# EAGLE design logic_alpha0001 (EAGLE 6.4)
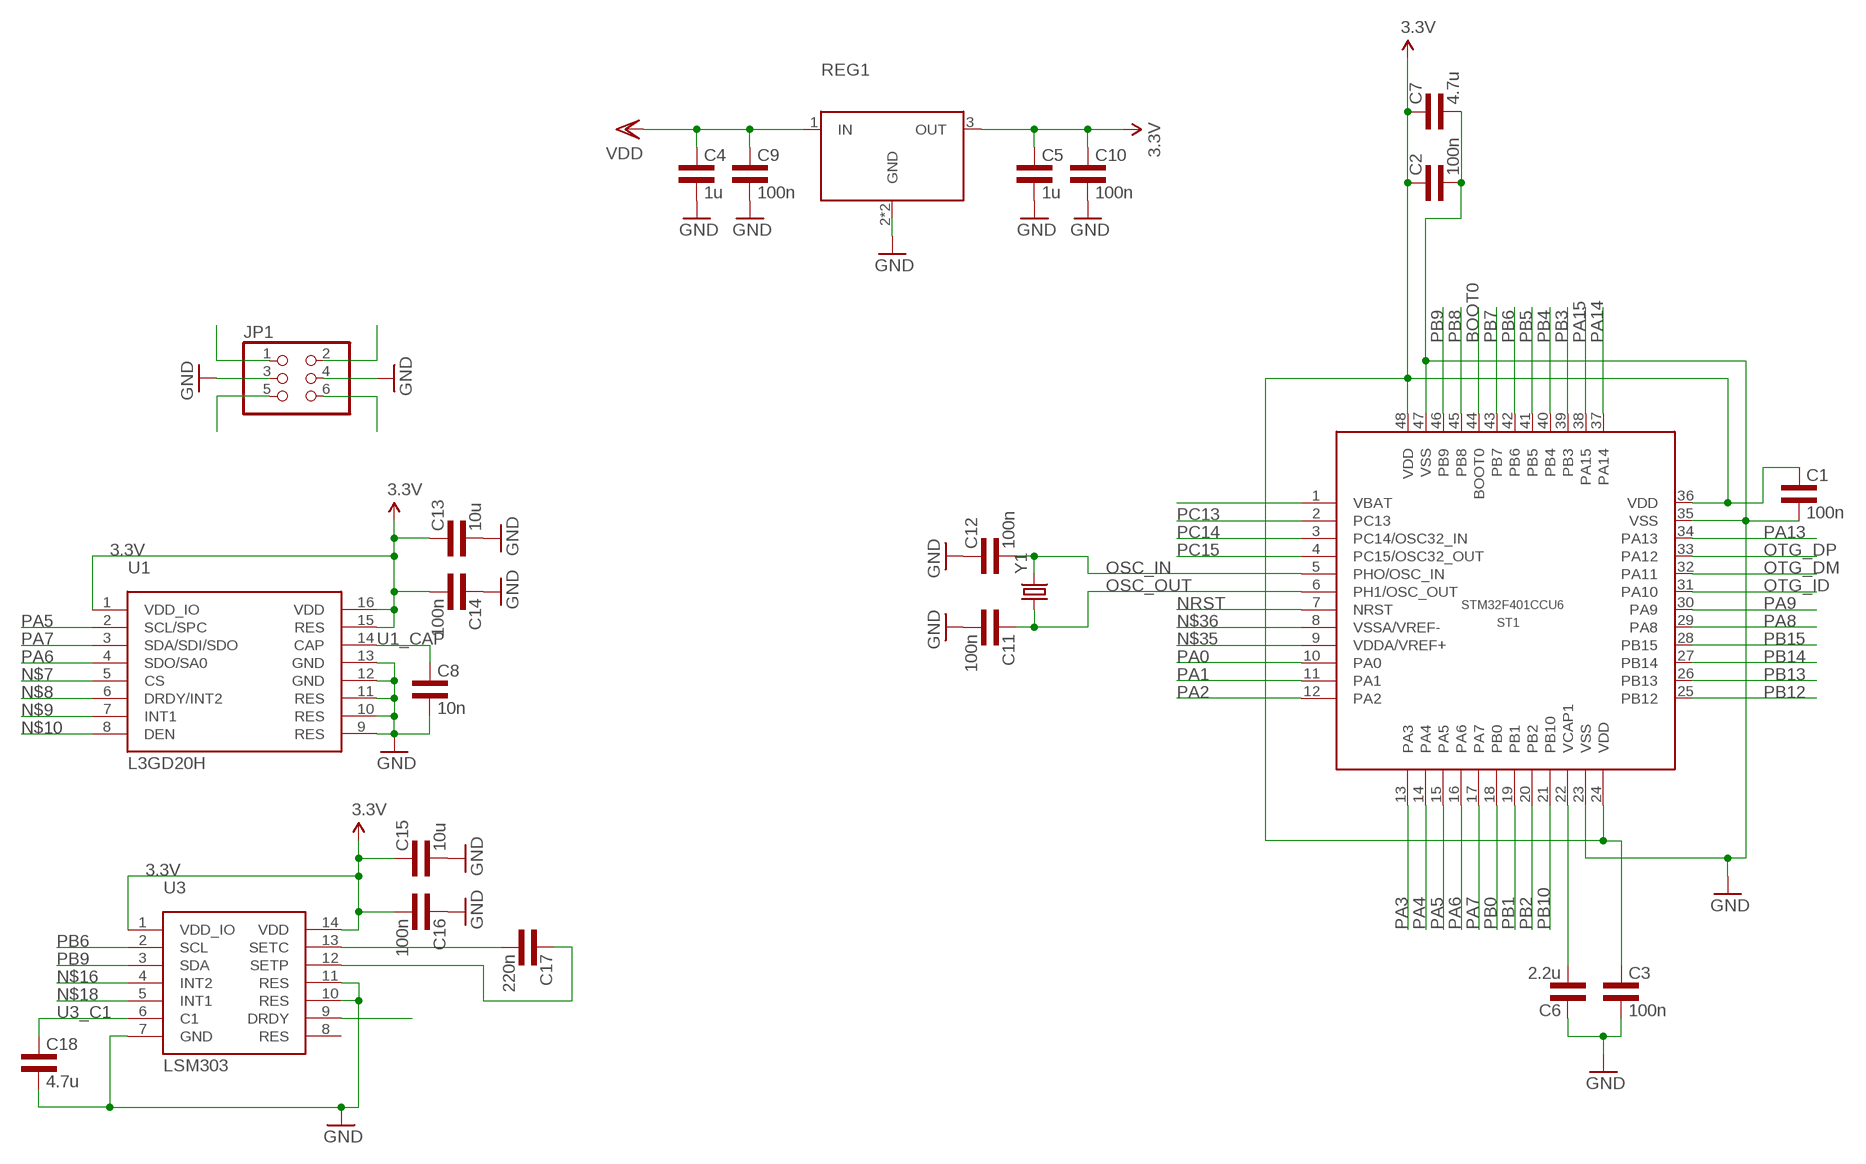
[diagram p0: schematic, sheet 1]

## Parts
C1  100n  CAP0402L3  [0402L3]
C2  100n  CAP0402L3  [0402L3]
C3  100n  CAP0402L3  [0402L3]
C4  1u  CAP0805L3  [0805L3]
C5  1u  CAP0805L3  [0805L3]
C6  2.2u  CAP0402L3  [0402L3]
C7  4.7u  CAP0805L3  [0805L3]
C8  10n  CAP0603L3  [0603L3]
C9  100n  CAP0603L3  [0603L3]
C10  100n  CAP0603L3  [0603L3]
C11  100n  CAP0402L3  [0402L3]
C12  100n  CAP0402L3  [0402L3]
C13  10u  CAP0805L3  [0805L3]
C14  100n  CAP0603L3  [0603L3]
C15  10u  CAP0805L3  [0805L3]
C16  100n  CAP0603L3  [0603L3]
C17  220n  CAP0603L3  [0603L3]
C18  4.7u  CAP0603L3  [0603L3]
JP1  PINHD-2X3  [2X03]
REG1  LDO_REG_4PIN  [SOT-223-3]
ST1  STM32F401CCU6  [UFQFPN48]
U1  L3GD20H  [LGA16R50P3X5_300X300X100]
U3  LSM303  [LGA14]
Y1  CRYSTALHC49US  [HC49US]

## Nets
3.3V: C1.P$1 C2.P$1 C3.P$1 C5.1 C7.1 C10.P$1 C13.1 C14.P$2 C15.1 C16.P$2 REG1.3(OUT) ST1.24(VDD) ST1.36(VDD) ST1.48(VDD) U1.1(VDD_IO) U1.15(RES) U1.16(VDD) U3.1(VDD_IO) U3.14(VDD)
BOOT0: ST1.44(BOOT0)
GND: C1.P$2 C2.P$2 C3.P$2 C4.2 C5.2 C6.P$1 C7.2 C8.P$2 C9.P$2 C10.P$2 C11.P$2 C12.P$1 C13.2 C14.P$1 C15.2 C16.P$1 C18.P$2 JP1.3 JP1.4 REG1.2(GND) REG1.4(GND) ST1.23(VSS) ST1.35(VSS) ST1.47(VSS) U1.9(RES) U1.10(RES) U1.11(RES) U1.12(GND) U1.13(GND) U3.7(GND) U3.10(RES) U3.11(RES)
HIN1_IN: JP1.1
HIN2_IN: JP1.5
LIN1_IN: JP1.2
LIN2_IN: JP1.6
N$6: ST1.1(VBAT)
N$7: U1.5(CS)
N$8: U1.6(DRDY/INT2)
N$9: U1.7(INT1)
N$10: U1.8(DEN)
N$16: U3.4(INT2)
N$17: C6.P$2 ST1.22(VCAP1)
N$18: U3.5(INT1)
N$20: C17.P$2 U3.13(SETC)
N$21: C17.P$1 U3.12(SETP)
N$22: U3.9(DRDY)
N$35: ST1.9(VDDA/VREF+)
N$36: ST1.8(VSSA/VREF-)
NRST: ST1.7(NRST)
OSC_IN: C12.P$2 ST1.5(PHO/OSC_IN) Y1.2
OSC_OUT: C11.P$1 ST1.6(PH1/OSC_OUT) Y1.1
OTG_DM: ST1.32(PA11)
OTG_DP: ST1.33(PA12)
OTG_ID: ST1.31(PA10)
PA0: ST1.10(PA0)
PA1: ST1.11(PA1)
PA2: ST1.12(PA2)
PA3: ST1.13(PA3)
PA4: ST1.14(PA4)
PA5: ST1.15(PA5) U1.2(SCL/SPC)
PA6: ST1.16(PA6) U1.4(SDO/SA0)
PA7: ST1.17(PA7) U1.3(SDA/SDI/SDO)
PA8: ST1.29(PA8)
PA9: ST1.30(PA9)
PA13: ST1.34(PA13)
PA14: ST1.37(PA14)
PA15: ST1.38(PA15)
PB0: ST1.18(PB0)
PB1: ST1.19(PB1)
PB2: ST1.20(PB2)
PB3: ST1.39(PB3)
PB4: ST1.40(PB4)
PB5: ST1.41(PB5)
PB6: ST1.42(PB6) U3.2(SCL)
PB7: ST1.43(PB7)
PB8: ST1.45(PB8)
PB9: ST1.46(PB9) U3.3(SDA)
PB10: ST1.21(PB10)
PB12: ST1.25(PB12)
PB13: ST1.26(PB13)
PB14: ST1.27(PB14)
PB15: ST1.28(PB15)
PC13: ST1.2(PC13)
PC14: ST1.3(PC14/OSC32_IN)
PC15: ST1.4(PC15/OSC32_OUT)
U1_CAP: C8.P$1 U1.14(CAP)
U3_C1: C18.P$1 U3.6(C1)
VDD: C4.1 C9.P$1 REG1.1(IN)
Unconnected: U3.8(RES)

## Library data of the parts
C1-C18 = common:CAP
JP1 = pinhead:PINHD-2X3: PIN HEADER
REG1 = common:LDO_REG_4PIN
ST1 = common:STM32F401CCU6
U1 = ST Microelctronics_By_element14_Batch_1:L3GD20H
U3 = SparkFun-Sensors:LSM303
Y1 = SparkFun-FreqCtrl:CRYSTAL: Various standard crystals. Proven footprints. Spark Fun Electronics SKU : COM-00534

## Board
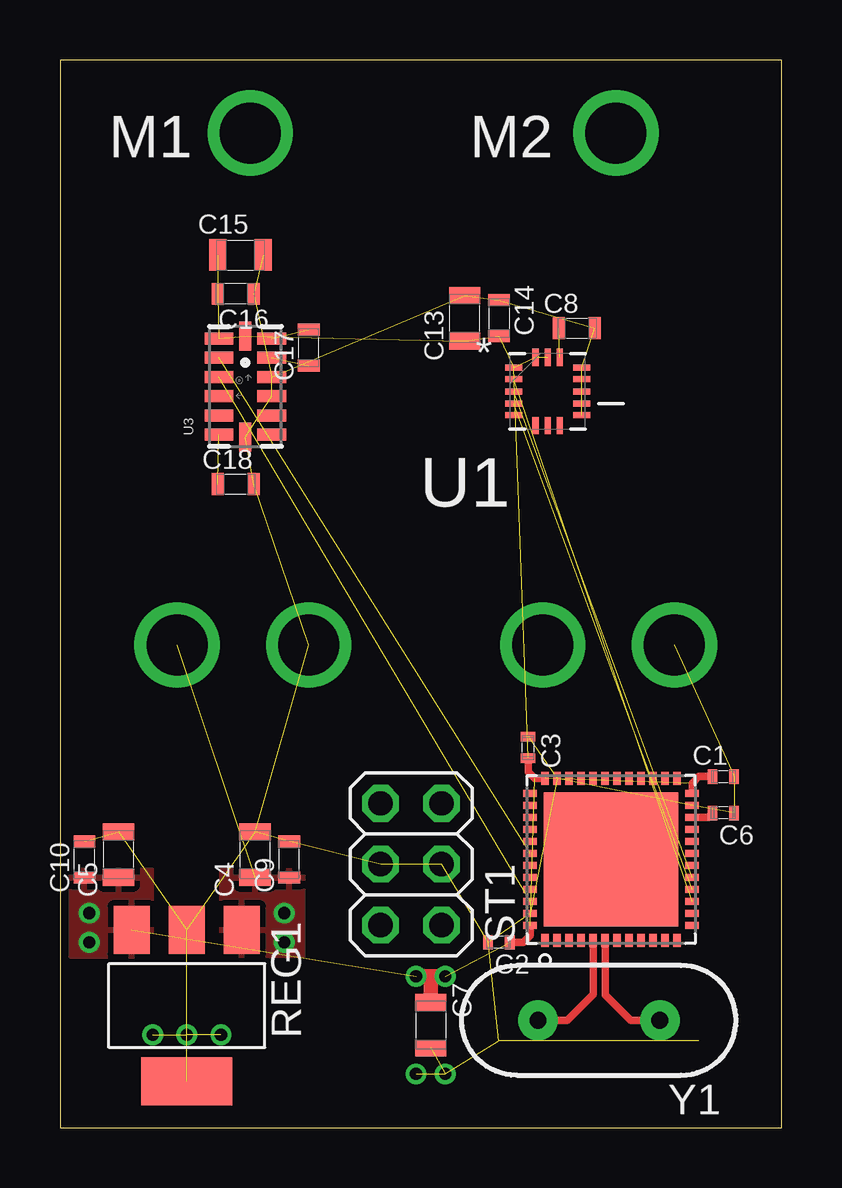
[diagram p1: board, top side]
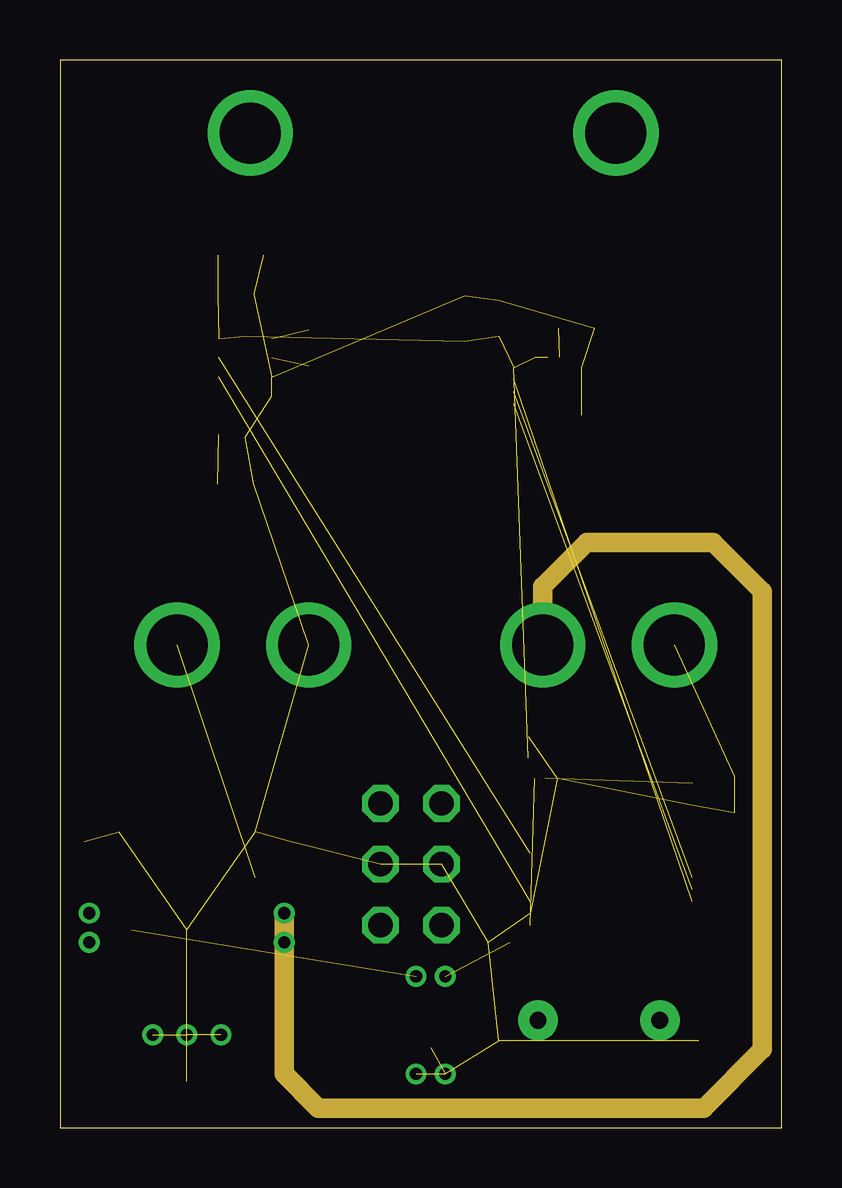
[diagram p2: board, inner layer Route3]
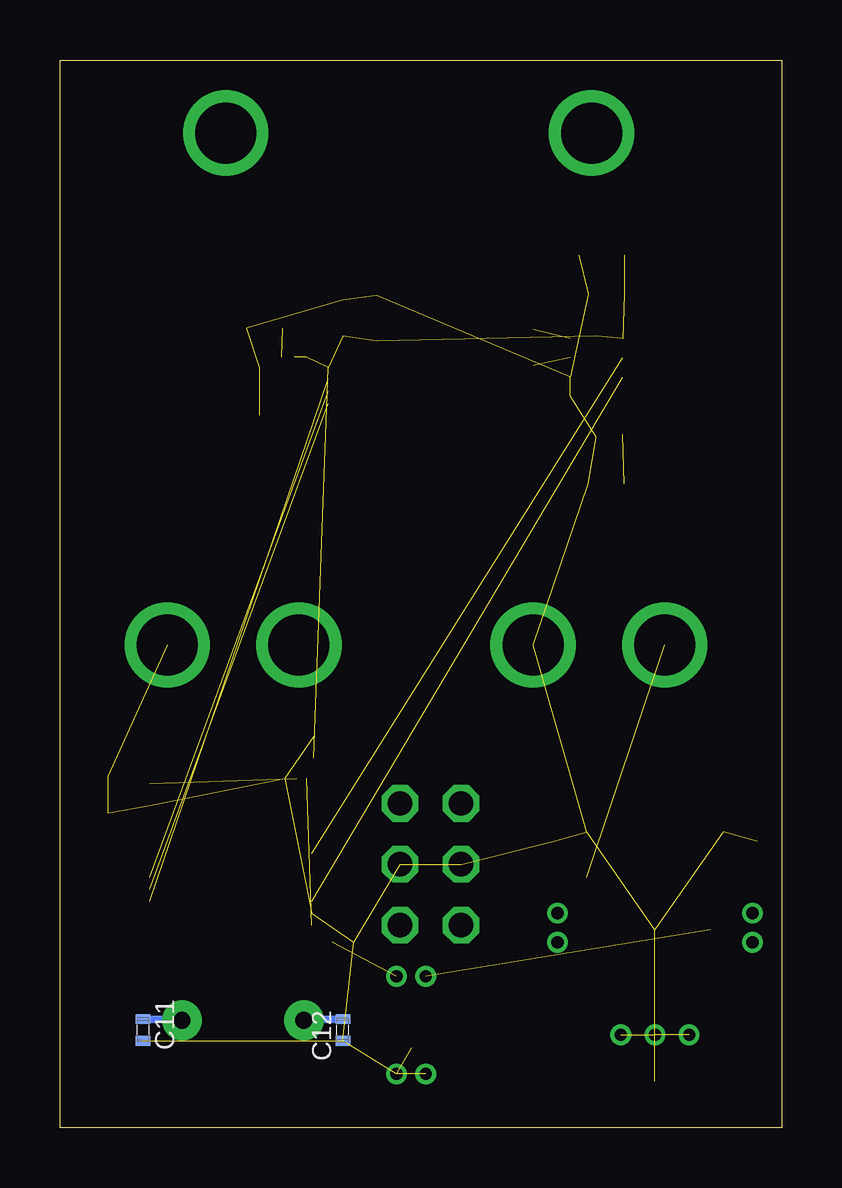
[diagram p3: board, bottom side, seen from below]

Size 30.07 x 44.5 mm. Coordinates in mm from the lower left corner, seen from the top.
Outline: 0,0 30.07,0 30.07,44.5 0,44.5 0,0
Copper layers (1*16): Top 0.035mm / dielectric 1.5mm / Bottom 0.035mm
Design rules "default *": minimum track width 8mil, minimum drill 13mil, track to track 8mil, track to pad 8mil, pad to pad 8mil, via to via 8mil, smd to smd 8mil, copper to edge 13mil, drill to drill 8mil, minimum pad ring 7mil, minimum via ring 7mil, stop-mask expansion 4mil, vias tented up to drill 0mil, thermal gap 10mil

### Footprints (pad centres in the part's own frame; a part is rotated, then mirrored left to right if it is on the bottom)
0402L3 = smd 0.4 x 0.6: P$1 -0.45,0; P$2 0.45,0
0805L3 = smd 0.7 x 1.3: 1 -0.95,0; 2 0.95,0
0603L3 = smd 0.5 x 0.9: P$1 -0.75,0; P$2 0.75,0
2X03 = drill 1.016 octagon: 1 -2.54,-1.27; 2 -2.54,1.27; 3 0,-1.27; 4 0,1.27; 5 2.54,-1.27; 6 2.54,1.27
SOT-223-3 = smd 1.5 x 2: 1 -2.3,-3.15; 2 0,-3.15; 3 2.3,-3.15 | smd 3.8 x 2: 4 0,3.15
UFQFPN48 = smd 0.55 x 0.3: 1 -3.375,2.75; 2 -3.375,2.25; 3 -3.375,1.75; 4 -3.375,1.25; 5 -3.375,0.75; 6 -3.375,0.25; 7 -3.375,-0.25; 8 -3.375,-0.75; 9 -3.375,-1.25; 10 -3.375,-1.75; 11 -3.375,-2.25; 12 -3.375,-2.75; 25 3.375,-2.75; 26 3.375,-2.25; 27 3.375,-1.75; 28 3.375,-1.25; 29 3.375,-0.75; 30 3.375,-0.25; 31 3.375,0.25; 32 3.375,0.75; 33 3.375,1.25; 34 3.375,1.75; 35 3.375,2.25; 36 3.375,2.75 | smd 0.3 x 0.55: 13 -2.75,-3.375; 14 -2.25,-3.375; 15 -1.75,-3.375; 16 -1.25,-3.375; 17 -0.75,-3.375; 18 -0.25,-3.375; 19 0.25,-3.375; 20 0.75,-3.375; 21 1.25,-3.375; 22 1.75,-3.375; 23 2.25,-3.375; 24 2.75,-3.375; 37 2.75,3.375; 38 2.25,3.375; 39 1.75,3.375; 40 1.25,3.375; 41 0.75,3.375; 42 0.25,3.375; 43 -0.25,3.375; 44 -0.75,3.375; 45 -1.25,3.375; 46 -1.75,3.375; 47 -2.25,3.375; 48 -2.75,3.375 | smd 5.6 x 5.6: TP 0,0
LGA16R50P3X5_300X300X100 = smd 0.711 x 0.254: 1 -1.422,0.991; 2 -1.422,0.508; 3 -1.422,0; 4 -1.422,-0.508; 5 -1.422,-0.991; 9 1.422,-0.991; 10 1.422,-0.508; 11 1.422,0; 12 1.422,0.508; 13 1.422,0.991 | smd 0.254 x 0.711: 6 -0.508,-1.422; 7 0,-1.422; 8 0.508,-1.422; 14 0.508,1.422; 15 0,1.422; 16 -0.508,1.422
LGA14 = smd 0.5 x 1.2: 1 2,1.1; 2 1.2,1.1; 3 0.4,1.1; 4 -0.4,1.1; 5 -1.2,1.1; 6 -2,1.1; 8 -2,-1.1; 9 -1.2,-1.1; 10 -0.4,-1.1; 11 0.4,-1.1; 12 1.2,-1.1; 13 2,-1.1 | smd 1.2 x 0.5: 7 -2.1,0; 14 2.1,0
HC49US = drill 0.7 pad 1.651: 1 -2.54,0; 2 2.54,0

### Placement (x,y rotation side)
C1  27.64,14.63 0 top
C2  18.29,7.72 180 top
C3  19.51,15.85 90 top
C4  8.13,11.38 90 top
C5  2.44,11.38 90 top
C6  27.64,13.11 180 top
C7  15.44,4.27 270 top
C8  21.54,33.32 0 top
C9  9.55,11.18 90 top
C10  1.02,11.18 90 top
C11  26.62,4.06 270 bottom
C12  18.29,4.06 90 bottom
C13  16.87,33.73 90 top
C14  18.29,33.73 270 top
C15  7.52,36.37 0 top
C16  7.32,34.75 180 top
C17  10.36,32.51 90 top
C18  7.32,26.82 0 top
JP1  14.63,10.97 90 top
REG1  5.28,5.08 180 top
ST1  22.96,11.18 90 top
U1  20.32,30.68 0 top
U3  7.72,30.89 90 top
Y1  22.45,4.47 180 top

### Tracks (layer width: path | path; a pad name or v marks a point on that pad's centre or on a via)
3.3V  (via drill 0.51)  (13 unrouted)
  Top 0.305: ST1.48 19.59,8 19.3,7.72 C2.P$1 | ST1.36 19.79,14.55 19.51,14.83 C3.P$1 | ST1.24 26.34,14.35 26.62,14.63 C1.P$1
  Top 0.61: v16.05,6.3 15.44,6.3 | 15.44,6.3 v14.83,6.3 | C7.1 15.44,6.3
  other vias: 1.22,8.94 1.22,7.72
  pour Top: 3.86,7.11 3.86,10.77 0.41,10.77 0.41,7.11
GND  (via drill 0.51, 2.54)  (38 unrouted)
  other vias: 10.36,20.12 25.6,20.12 6.71,3.86 3.86,3.86 14.83,2.24 16.05,2.24 5.28,3.86
MOTOR_OUT_1  (via drill 2.54)
  other vias: 7.92,41.45
MOTOR_OUT_2  (via drill 2.54)
  other vias: 23.16,41.45
N$17
  Top 0.305: ST1.22 27,12.93 C6.P$2
N$20  (1 unrouted)
N$21  (1 unrouted)
OSC_IN
  Top 0.305: ST1.5 22.21,5.55 21.13,4.47 Y1.2
  Bottom 0.305: C12.P$2 19.87,4.51 Y1.2
OSC_OUT
  Top 0.305: ST1.6 22.71,5.53 23.77,4.47 Y1.1
  Bottom 0.305: C11.P$1 25.04,4.51 Y1.1
PA5  (1 unrouted)
PA6  (1 unrouted)
PA7  (1 unrouted)
PB6  (1 unrouted)
PB9  (1 unrouted)
U1_CAP  (1 unrouted)
U3_C1  (1 unrouted)
VDD  (via drill 0.51, 2.54)  (1 unrouted)
  Route3 0.813: v20.12,20.12 20.12,22.55 21.95,24.38 27.23,24.38 29.26,22.35 29.26,3.25 26.82,0.81 10.77,0.81 9.35,2.23 v9.35,8.94
  other vias: 4.88,20.12 9.35,7.72
  pour Top: 6.71,7.11 6.71,10.77 10.16,10.77 10.16,7.11

### Text on the board
tPlace: M1 | M2